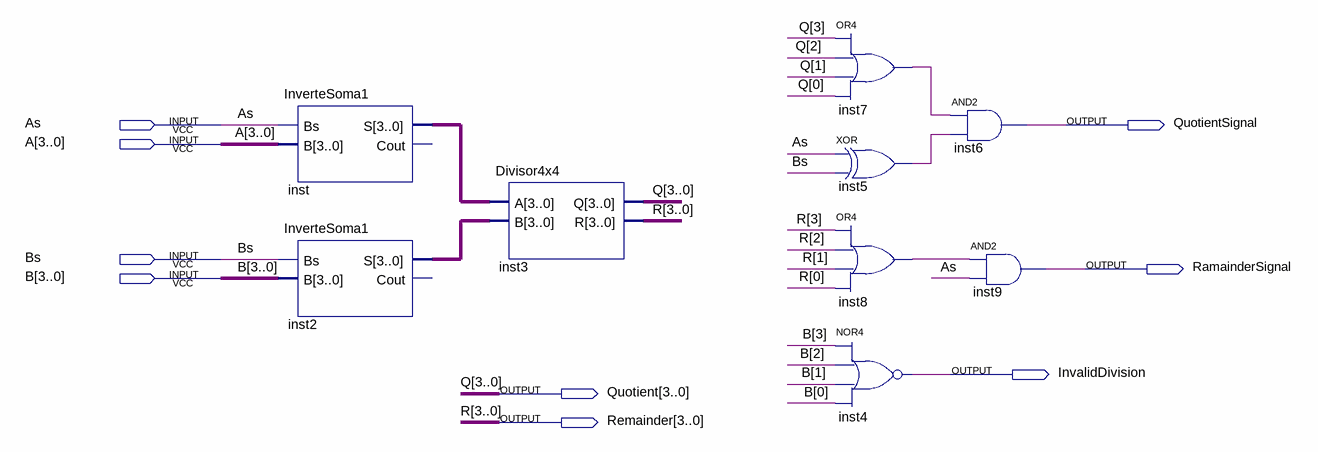
[diagram p0: schematic sheet]
// Quartus schematic DivisorDe4BitsComSinal.bdf as structural Verilog: 9 symbols, 9 pins
module DivisorDe4BitsComSinal (
  input  As,
  input  [3:0] A,
  input  Bs,
  input  [3:0] B,
  output QuotientSignal,
  output RamainderSignal,
  output InvalidDivision,
  output [3:0] Quotient,
  output [3:0] Remainder
);

  wire inst5_out, inst7_out, inst8_out;
  wire [3:0] inst2_s, inst_s;

  InverteSoma1 inst (.Bs(As), .B(A), .S(inst_s));  // open: Cout
  InverteSoma1 inst2 (.Bs(Bs), .B(B), .S(inst2_s));  // open: Cout
  Divisor4x4 inst3 (.A(inst_s), .B(inst2_s), .R(Remainder), .Q(Quotient));
  or inst7 (inst7_out, Quotient[3], Quotient[2], Quotient[1], Quotient[0]);
  xor inst5 (inst5_out, As, Bs);
  or inst8 (inst8_out, Remainder[3], Remainder[2], Remainder[1], Remainder[0]);
  nor inst4 (InvalidDivision, B[3], B[2], B[1], B[0]);
  and inst6 (QuotientSignal, inst7_out, inst5_out);
  and inst9 (RamainderSignal, inst8_out, As);

  // Other names for the same wires on the sheet: Q[3:0] = Quotient; R[3:0] = Remainder
endmodule
